# Altium schematic sheet rf_frontend.SchDoc
size A4
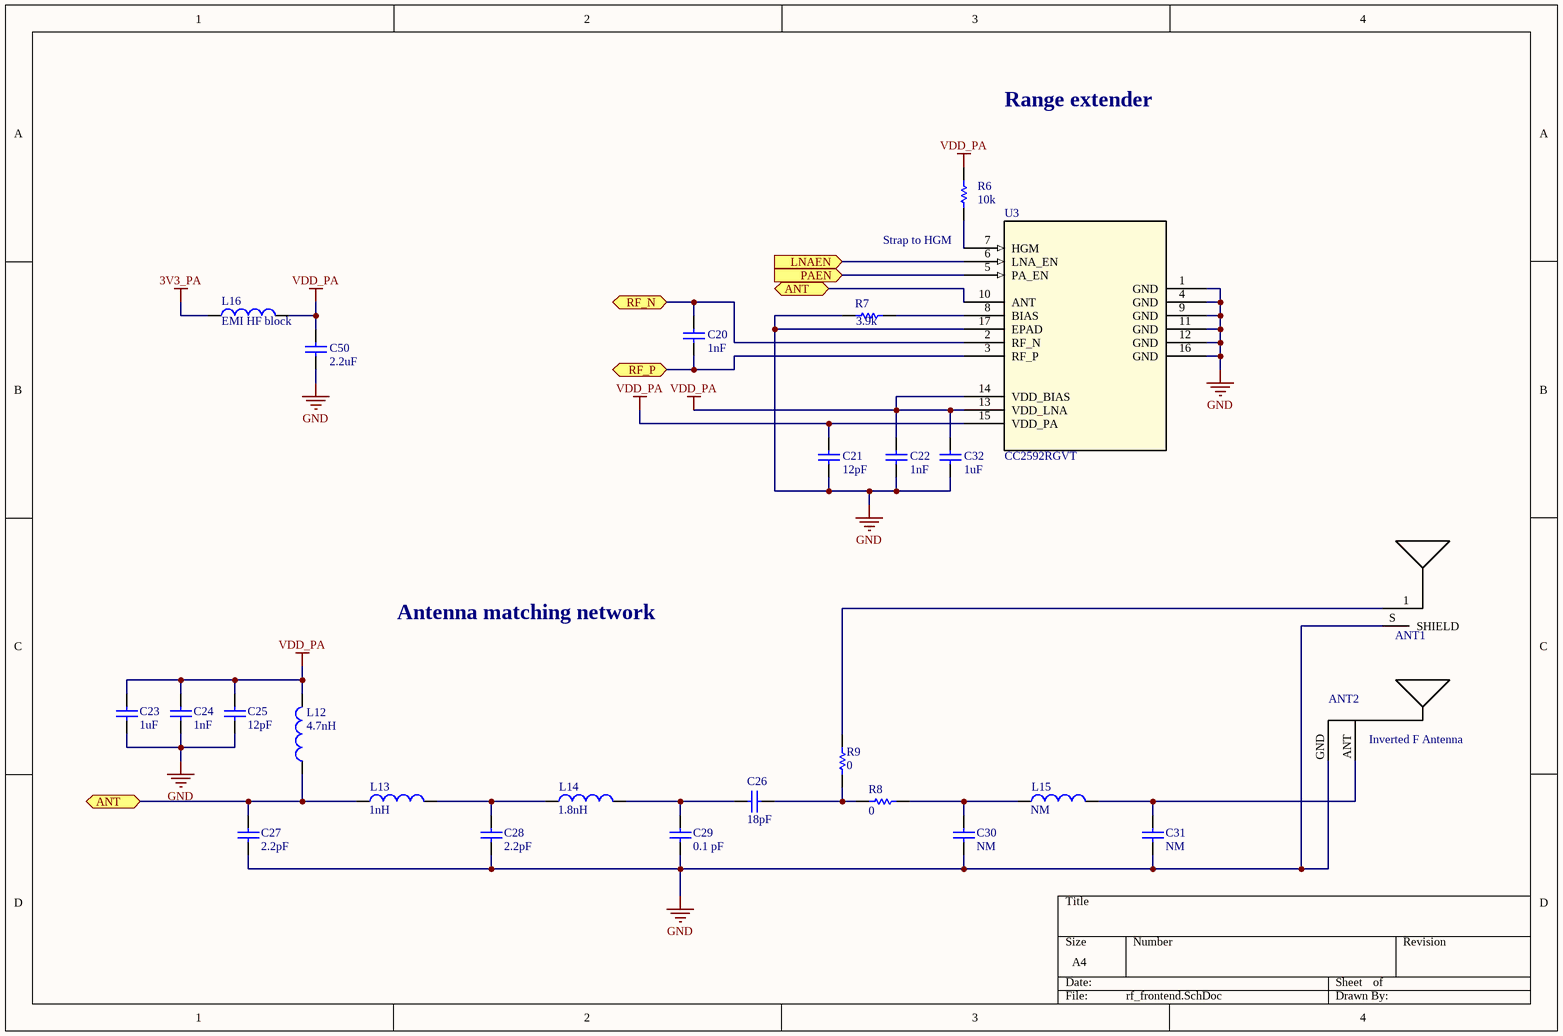
[diagram p0: rf_frontend.SchDoc]

## Parts
ANT1  SMA RP Antenna  [SMA ANTENNA]  (value not drawn)
ANT2  Inverted F ANT  [INVERTED_F_ANT]  (value not drawn)
C20  value 1nF  [C_0402]
C21  value 12pF  [C_0402]
C22  value 1nF  [C_0402]
C23  value 1uF  [C_0402_RF_IN_OUT]
C24  value 1nF  [C_0402_RF_IN_OUT]
C25  value 12pF  [C_0402_RF_IN_OUT]
C26  value 18pF  [C_0402_RF_IN]
C27  value 2.2pF  [C_0402_RF_IN_OUT]
C28  value 2.2pF  [C_0402_RF_IN_OUT]
C29  value 0.1 pF  [C_0402_RF_IN_OUT]
C30  value NM  [C_0402_RF_IN_OUT]
C31  value NM  [C_0402_RF_IN_OUT]
C32  value 1uF  [C_0402]
C50  value 2.2uF  [C_0402]
L12  value 4.7nH  [R_0402_IN_OUT]  (hidden comment: Inductor)
L13  value 1nH  [L_0402_RF_IN]  (hidden comment: Inductor)
L14  value 1.8nH  [L_0402_RF_IN]  (hidden comment: Inductor)
L15  value NM  [L_0402_RF_IN]  (hidden comment: Inductor)
L16  value EMI HF block  [L_0402]  (hidden comment: Inductor)
R6  value 10k  [R_0402]  (hidden comment: Res1)
R7  value 3.9k  [R_0402]  (hidden comment: Res1)
R8  value 0  [R_0402_IN_OUT]  (hidden comment: Res1)
R9  value 0  [R_0402_IN]  (hidden comment: Res1)
U3  CC2592RGVT  [RGV16_2P16X2P16]

## Ports
ANT (bidir), LNAEN (in), PAEN (in), RF_N (bidir), RF_P (bidir)

## Nets
3V3_PA: L16.1
GND: ANT1.S(SHIELD) ANT2.GND C21.1 C22.1 C23.2 C24.2 C25.2 C27.2 C28.2 C29.2 C30.2 C31.2 C32.1 C50.1 R7.2 U3.1(GND) U3.4(GND) U3.9(GND) U3.11(GND) U3.12(GND) U3.16(GND) U3.17(EPAD)
VDD_PA: C21.2 C22.2 C23.1 C24.1 C25.1 C32.2 C50.2 L12.2 L16.2 R6.2 U3.13(VDD_LNA) U3.14(VDD_BIAS) U3.15(VDD_PA)
ANT: C27.1 L12.1 L13.1 U3.10(ANT) ; port ANT
LNAEN: U3.6(LNA_EN) ; port LNAEN
PAEN: U3.5(PA_EN) ; port PAEN
RF_N: C20.2 U3.2(RF_N) ; port RF_N
RF_P: C20.1 U3.3(RF_P) ; port RF_P
NetANT1_1: ANT1.1(FEED) R9.1
NetANT2_ANT: ANT2.ANT C31.1 L15.2
NetC26_1: C26.1 R8.1 R9.2
NetC26_2: C26.2 C29.1 L14.2
NetC28_1: C28.1 L13.2 L14.1
NetC30_1: C30.1 L15.1 R8.2
NetR6_1: R6.1 U3.7(HGM)
NetR7_1: R7.1 U3.8(BIAS)

## Notes on the sheet
- Range extender
- (near R6) Strap to HGM
- Antenna matching network
- (in symbol Inverted F ANT) Inverted F Antenna

## Library data of the parts
C20-C32 C50 = Cap
R6-R9 = Res1: Resistor
U3 = CC2592RGVT: Imported; Built_By: EMA_UL_Team; Vendor: Texas Instruments; Manufacturer_Part_Number: CC2592RGVT; RefDes: RefDes; Type: DEV; Value: Value